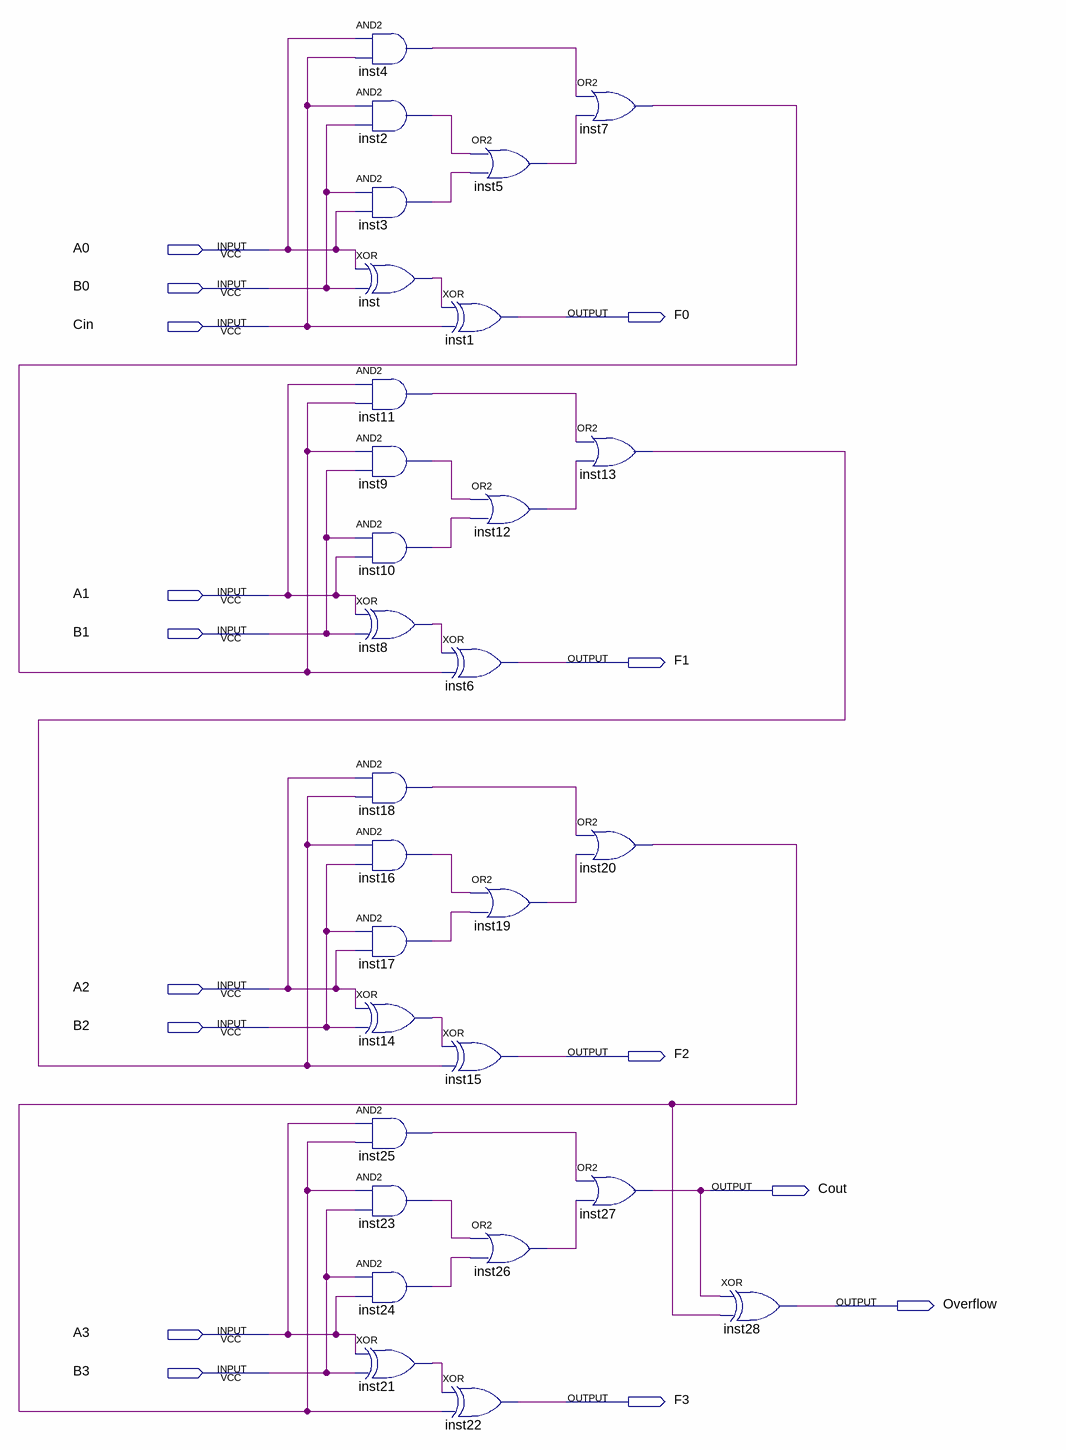
[diagram p0: schematic sheet]
// Quartus schematic Ex6_Full_overflow.bdf as structural Verilog: 29 symbols, 15 pins
module Ex6_Full_overflow (
  input  A0,
  input  B0,
  input  Cin,
  input  A1,
  input  B1,
  input  A2,
  input  B2,
  input  A3,
  input  B3,
  output F0,
  output F1,
  output F2,
  output Cout,
  output Overflow,
  output F3
);

  wire inst2_out, inst3_out, inst4_out, inst5_out, inst7_out, inst8_out, inst9_out, inst10_out, inst11_out,
       inst12_out, inst13_out, inst14_out, inst16_out, inst17_out, inst18_out, inst19_out, inst20_out,
       inst21_out, inst23_out, inst24_out, inst25_out, inst26_out, inst_out;

  and inst4 (inst4_out, A0, Cin);
  and inst2 (inst2_out, Cin, B0);
  and inst3 (inst3_out, B0, A0);
  xor inst (inst_out, A0, B0);
  and inst11 (inst11_out, A1, inst7_out);
  and inst9 (inst9_out, inst7_out, B1);
  and inst10 (inst10_out, B1, A1);
  xor inst8 (inst8_out, A1, B1);
  and inst18 (inst18_out, A2, inst13_out);
  and inst16 (inst16_out, inst13_out, B2);
  and inst17 (inst17_out, B2, A2);
  xor inst14 (inst14_out, A2, B2);
  and inst25 (inst25_out, A3, inst20_out);
  and inst23 (inst23_out, inst20_out, B3);
  and inst24 (inst24_out, B3, A3);
  xor inst21 (inst21_out, A3, B3);
  xor inst1 (F0, inst_out, Cin);
  xor inst6 (F1, inst8_out, inst7_out);
  xor inst15 (F2, inst14_out, inst13_out);
  xor inst22 (F3, inst21_out, inst20_out);
  or inst5 (inst5_out, inst2_out, inst3_out);
  or inst12 (inst12_out, inst9_out, inst10_out);
  or inst19 (inst19_out, inst16_out, inst17_out);
  or inst26 (inst26_out, inst23_out, inst24_out);
  or inst7 (inst7_out, inst4_out, inst5_out);
  or inst13 (inst13_out, inst11_out, inst12_out);
  or inst20 (inst20_out, inst18_out, inst19_out);
  or inst27 (Cout, inst25_out, inst26_out);
  xor inst28 (Overflow, Cout, inst20_out);
endmodule
